# EAGLE design MIB (EAGLE 7.6.0)
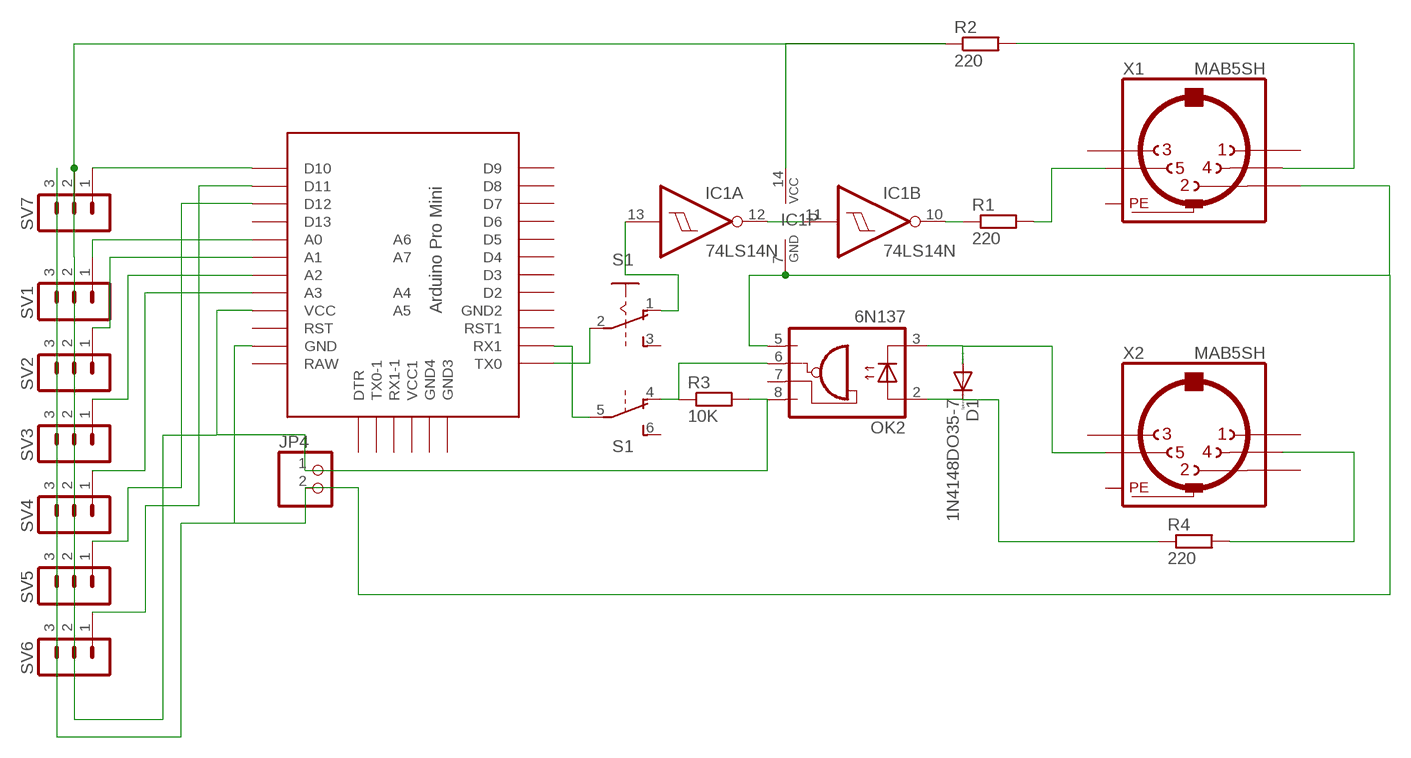
[diagram p0: schematic, sheet 1]

## Parts
D1  1N4148DO35-7  [DO35-7]
IC1  74LS14N  [DIL14]
JP4  PINHD-1X2  [1X02]
OK2  6N137  [DIL08]
R1  220  R-EU_0207/10  [0207/10]
R2  220  R-EU_0207/10  [0207/10]
R3  10K  R-EU_0207/10  [0207/10]
R4  220  R-EU_0207/10  [0207/10]
S1  A68-A31  [A68-A31]
SV1  MA03-1  [MA03-1]
SV2  MA03-1  [MA03-1]
SV3  MA03-1  [MA03-1]
SV4  MA03-1  [MA03-1]
SV5  MA03-1  [MA03-1]
SV6  MA03-1  [MA03-1]
SV7  MA03-1  [MA03-1]
U$1  PRO-MINI-2  [PRO-MINI-2]
X1  MAB5SH  [MAB5SH]
X2  MAB5SH  [MAB5SH]

## Nets
N$1: S1.5(B:P) U$1.RX1
N$2: IC1.11(B:I) IC1.12(A:O)
N$3: IC1.10(B:O) R1.1
N$4: D1.C OK2.2(A) R4.1
N$5: R4.2 X2.4
N$6: D1.A OK2.3(C) X2.5
N$7: R1.2 X1.5
N$8: R2.2 X1.4
N$9: IC1.14(P:VCC) JP4.1 OK2.8(VCC) R2.1 R3.2 SV1.2 SV2.2 SV3.2 SV4.2 SV5.2 SV6.2 SV7.2 U$1.VCC
N$10: OK2.6(VO) R3.1 S1.4(B:O)
N$11: IC1.7(P:GND) JP4.2 OK2.5(GND) SV1.3 SV2.3 SV3.3 SV4.3 SV5.3 SV6.3 SV7.3 U$1.GND X1.2
N$13: SV2.1 U$1.A1
N$14: SV3.1 U$1.A2
N$15: SV4.1 U$1.A3
N$16: SV1.1 U$1.A0
N$18: SV5.1 U$1.D12
N$19: SV6.1 U$1.D11
N$22: IC1.13(A:I) S1.1(A:O)
N$23: S1.2(A:P) U$1.TX0
N$30: SV7.1 U$1.D10
Unconnected: IC1.1(D:I) IC1.2(D:O) IC1.3(E:I) IC1.4(E:O) IC1.5(F:I) IC1.6(F:O) IC1.8(C:O) IC1.9(C:I) OK2.7(VE) S1.3(A:S) S1.6(B:S) U$1.A4 U$1.A5 U$1.A6 U$1.A7 U$1.D2 U$1.D3 U$1.D4 U$1.D5 U$1.D6 U$1.D7 U$1.D8 U$1.D9 U$1.D13 U$1.DTR U$1.GND1(GND2) U$1.GND2(GND3) U$1.GND3(GND4) U$1.RAW U$1.RST U$1.RST1 U$1.RX1-1 U$1.TX0-1 U$1.VCC1 X1.1 X1.3 X2.1 X2.2 X2.3

## Power pins joined to a net without a drawn wire
PE: X1.PE X1.PE@(PE) X2.PE X2.PE@(PE)

## Library data of the parts
D1 = diode:1N4148: DIODE high speed (Philips)
IC1 = 74xx-eu:74*14: Hex schmitt trigger INVERTER
JP4 = pinhead:PINHD-1X2: PIN HEADER
OK2 = optocoupler:6N137: MOTOROLA OPTO COUPLER; MPN: 6N137; OC_FARNELL: 1328376; OC_NEWARK: 52M1895
R1-R4 = rcl:R-EU_: RESISTOR, European symbol
S1 = switch:A68-A31: SLIDING SWITCH Siemens, distributor Buerklin, 11G766
SV1-SV7 = con-lstb:MA03-1: PIN HEADER; OC_FARNELL: unknown; OC_NEWARK: unknown
U$1 = Arduino-clone:PRO-MINI-2: Arduino Pro Mini Layout 2 Sparkfun.com
X1 X2 = con-hirschmann:MAB5SH: Female CONNECTOR 5 pins 90 deg. with shield, horizontal (DIN 41524); OC_FARNELL: 809883; OC_NEWARK: unknown

## Board
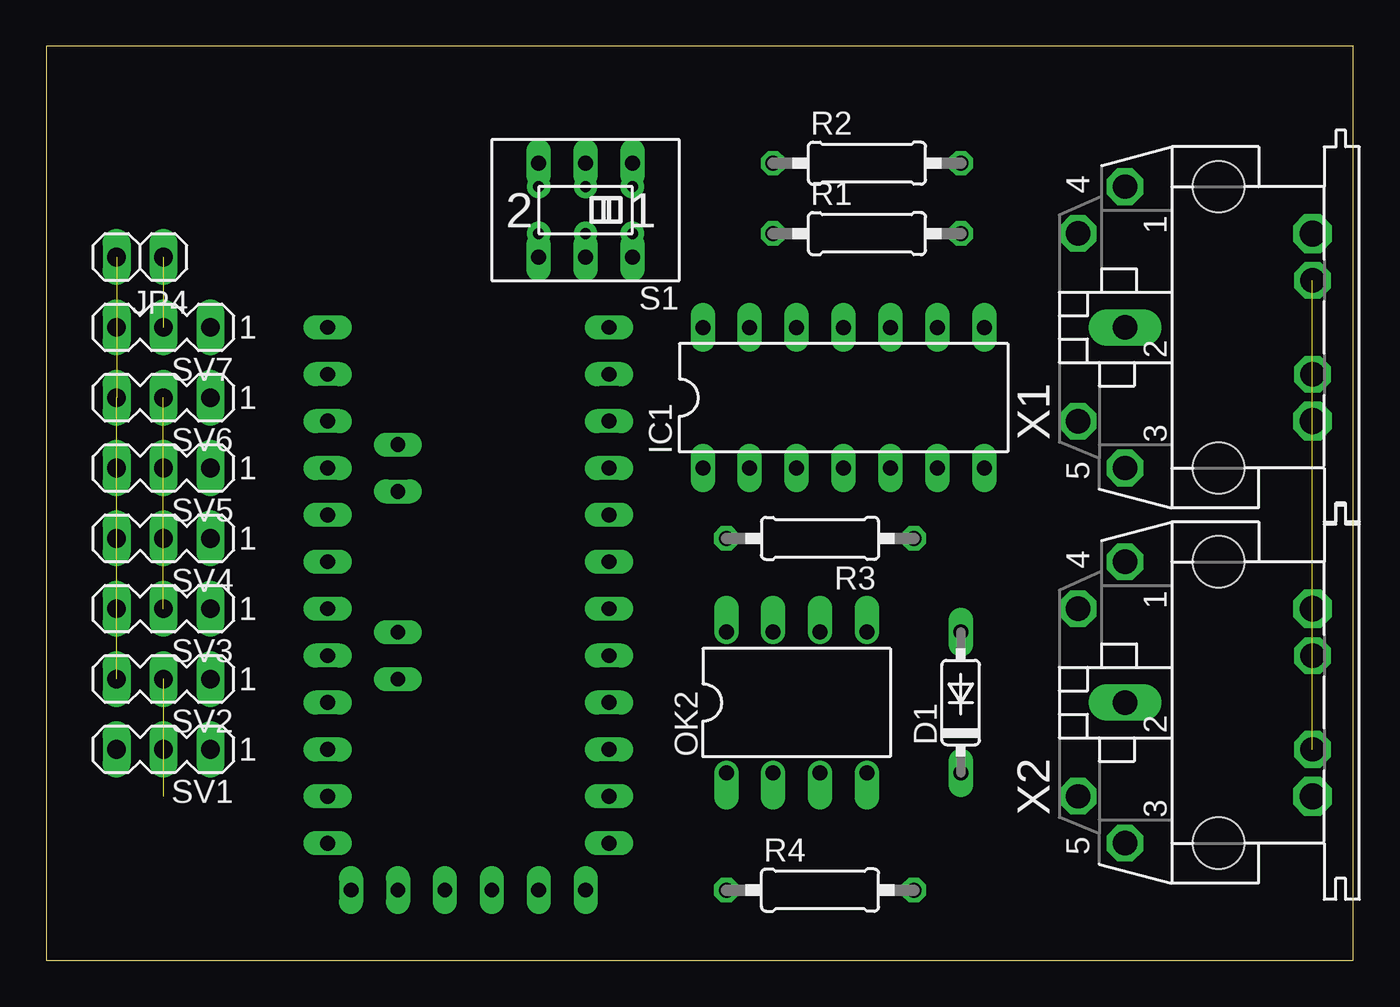
[diagram p1: board, top side]
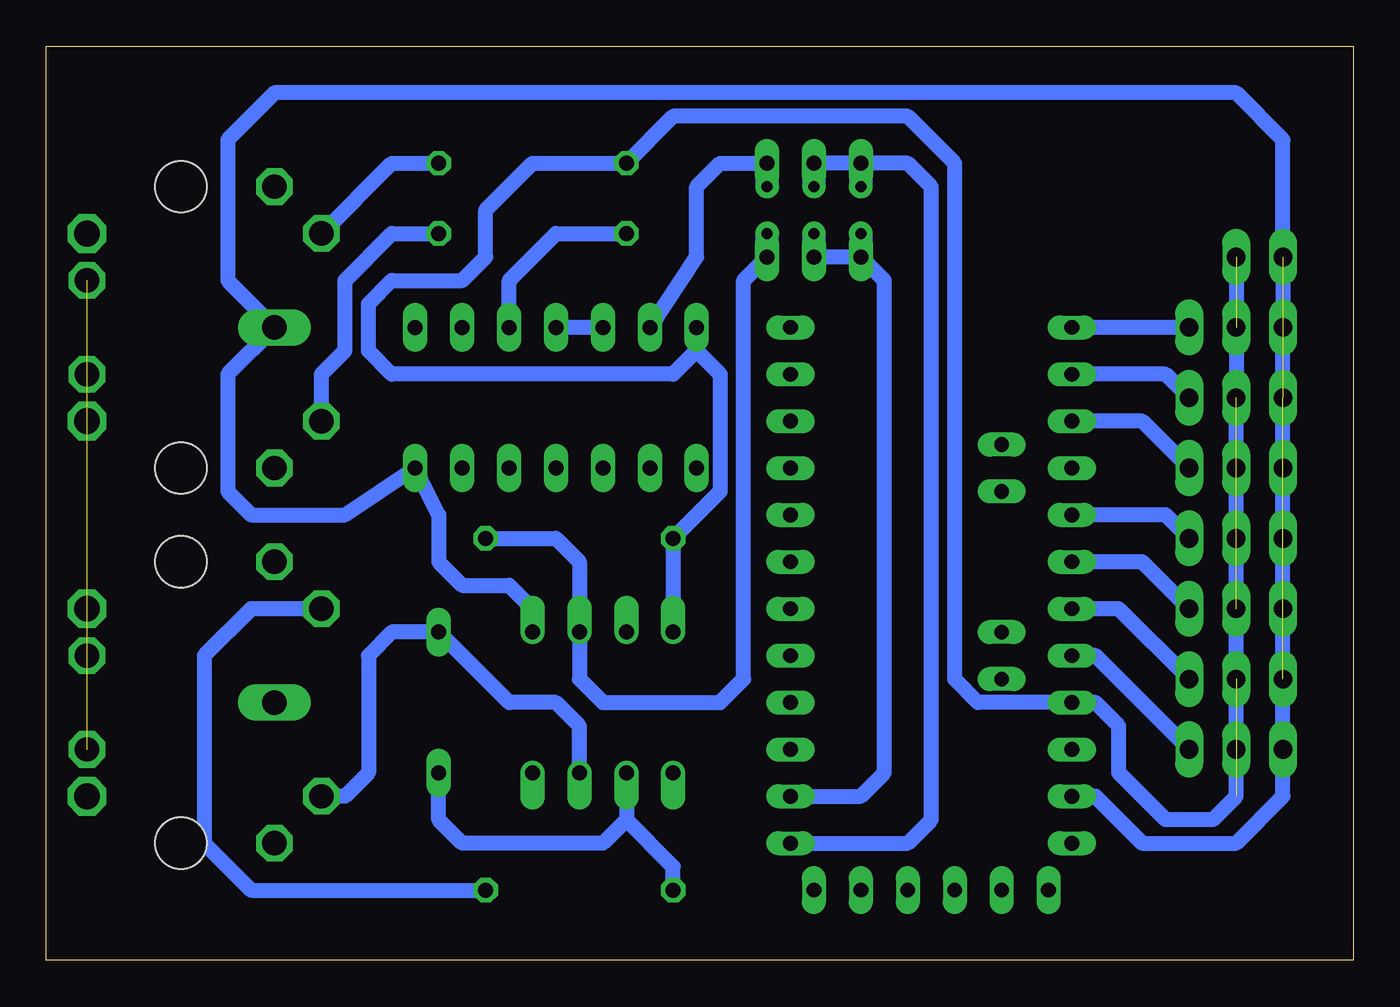
[diagram p2: board, bottom side, seen from below]

Size 70.79 x 49.52 mm. Coordinates in mm from the lower left corner, seen from the top.
Outline: 0,0 70.79,0 70.79,49.52 0,49.52 0,0
Copper layers (1*16): Top 0.035mm / dielectric 1.5mm / Bottom 0.035mm
Design rules "default": minimum track width 10mil, minimum drill 24mil, track to track 8mil, track to pad 8mil, pad to pad 8mil, via to via 8mil, smd to smd 8mil, copper to edge 40mil, drill to drill 8mil, minimum pad ring 10mil, minimum via ring 8mil, stop-mask expansion 4mil, vias tented up to drill 0mil, thermal gap 10mil

### Footprints (pad centres in the part's own frame; a part is rotated, then mirrored left to right if it is on the bottom)
DO35-7 = drill 0.813 long: A 3.81,0; C -3.81,0
DIL14 = drill 0.813 long: 1 -7.62,-3.81; 2 -5.08,-3.81; 3 -2.54,-3.81; 4 0,-3.81; 5 2.54,-3.81; 6 5.08,-3.81; 7 7.62,-3.81; 8 7.62,3.81; 9 5.08,3.81; 10 2.54,3.81; 11 0,3.81; 12 -2.54,3.81; 13 -5.08,3.81; 14 -7.62,3.81
1X02 = drill 1.016 long: 1 -1.27,0; 2 1.27,0
DIL08 = drill 0.813 offset: 1 -3.81,-3.81; 2 -1.27,-3.81; 3 1.27,-3.81; 4 3.81,-3.81; 5 3.81,3.81; 6 1.27,3.81; 7 -1.27,3.81; 8 -3.81,3.81
0207/10 = drill 0.813 octagon: 1 -5.08,0; 2 5.08,0
A68-A31 = drill 0.813 long: 1 -2.54,-2.54; 2 0,-2.54; 3 2.54,-2.54; 4 -2.54,2.54; 5 0,2.54; 6 2.54,2.54
MA03-1 = drill 1.016 long: 1 -2.54,0; 2 0,0; 3 2.54,0
PRO-MINI-2 = drill 0.8 long: A0 6.35,2.54; A1 6.35,0; A2 6.35,-2.54; A3 6.35,-5.08; A4 2.54,1.27; A5 2.54,3.81; A6 2.54,-8.89; A7 2.54,-6.35; D2 -8.89,2.54; D3 -8.89,0; D4 -8.89,-2.54; D5 -8.89,-5.08; D6 -8.89,-7.62; D7 -8.89,-10.16; D8 -8.89,-12.7; D9 -8.89,-15.24; D10 6.35,-15.24; D11 6.35,-12.7; D12 6.35,-10.16; D13 6.35,-7.62; DTR 5.08,15.24; GND 6.35,10.16; GND1 -8.89,5.08; GND2 -7.62,15.24; GND3 -5.08,15.24; RAW 6.35,12.7; RST 6.35,7.62; RST1 -8.89,7.62; RX1 -8.89,10.16; RX1-1 0,15.24; TX0 -8.89,12.7; TX0-1 2.54,15.24; VCC 6.35,5.08; VCC1 -2.54,15.24
MAB5SH = drill 1.321 octagon: 1 7.62,5.08; 3 -7.62,5.08; 4 5.08,7.62; 5 -5.08,7.62; PE -2.54,-5.08; PE@ 2.54,-5.08 | drill 1.321 long: 2 0,5.08 | hole 2.794: 7.62,0; -7.62,0

### Placement (x,y rotation side)
D1  49.53,13.97 90 top
IC1  43.18,30.48 0 top
JP4  5.08,38.1 180 top
OK2  40.64,13.97 0 top
R1  44.45,39.37 0 top
R2  44.45,43.18 0 top
R3  41.91,22.86 180 top
R4  41.91,3.81 0 top
S1  29.21,40.64 180 top
SV1  6.35,11.43 180 top
SV2  6.35,15.24 180 top
SV3  6.35,19.05 180 top
SV4  6.35,22.86 180 top
SV5  6.35,26.67 180 top
SV6  6.35,30.48 180 top
SV7  6.35,34.29 180 top
U$1  21.59,19.05 180 top
X1  63.5,34.29 90 top
X2  63.5,13.97 90 top

### Tracks (layer width: path | path; a pad name or v marks a point on that pad's centre or on a via)
N$1  (via drill 0.61 pad 1.27)
  Bottom 0.813: U$1.RX1 26.67,8.89 25.4,10.16 25.4,36.83 26.67,38.1 S1.5
  Bottom 1.27: 26.67,38.1 v26.67,39.37 | S1.5 v29.21,39.37
N$2
  Bottom 0.813: IC1.12 IC1.11
N$3
  Bottom 0.813: IC1.10 45.72,36.83 43.18,39.37 R1.1
N$4
  Bottom 0.813: R4.1 36.83,5.08 39.37,7.62 | OK2.2 39.37,7.62 | 39.37,7.62 40.64,6.35 48.26,6.35 49.53,7.62 D1.C
N$5
  Bottom 0.813: X2.4 59.69,19.05 62.23,16.51 62.23,6.35 59.69,3.81 R4.2
N$6
  Bottom 0.813: OK2.3 41.91,12.7 43.18,13.97 45.72,13.97 D1.A 52.07,17.78 53.34,16.51 53.34,10.16 54.61,8.89 X2.5
N$7
  Bottom 0.813: X1.5 55.88,31.75 54.61,33.02 54.61,36.83 52.07,39.37 R1.2
N$8
  Bottom 0.813: X1.4 52.07,43.18 R2.2
N$9  (6 unrouted)
  Bottom 0.813: JP4.1 SV6.2 6.35,8.89 7.62,7.62 10.16,7.62 12.7,10.16 12.7,12.7 13.97,13.97 U$1.VCC 20.32,13.97 21.59,15.24 21.59,43.18 24.13,45.72 36.83,45.72 R2.1 44.45,43.18 46.99,40.64 46.99,38.1 48.26,36.83 52.07,36.83 53.34,35.56 53.34,33.02 52.07,31.75 36.83,31.75 35.56,33.02 | OK2.8 R3.2 34.29,25.4 34.29,31.75 35.56,33.02 | 35.56,33.02 IC1.14
N$10  (via drill 0.61 pad 1.27)
  Bottom 0.813: R3.1 43.18,22.86 41.91,21.59 OK2.6 41.91,15.24 40.64,13.97 34.29,13.97 33.02,15.24 33.02,36.83 S1.4
  Bottom 1.27: S1.4 v31.75,39.37
N$11  (5 unrouted)
  Bottom 0.813: OK2.5 44.45,19.05 45.72,20.32 48.26,20.32 49.53,21.59 49.53,24.13 IC1.7 54.61,24.13 59.69,24.13 60.96,25.4 60.96,31.75 X1.2 60.96,36.83 60.96,44.45 58.42,46.99 6.35,46.99 3.81,44.45 JP4.2 SV7.3 SV1.3 3.81,8.89 6.35,6.35 11.43,6.35 13.97,8.89 U$1.GND
N$12  (via drill 1.4 pad 1.78)
  other vias: 68.58,8.89
N$13
  Bottom 0.813: SV2.1 12.7,19.05 U$1.A1
N$14
  Bottom 0.813: SV3.1 11.43,21.59 U$1.A2
N$15
  Bottom 0.813: SV4.1 10.16,24.13 U$1.A3
N$16
  Bottom 0.813: SV1.1 13.97,16.51 U$1.A0
N$17  (via drill 1.4 pad 1.78)
  other vias: 68.58,19.05
N$18
  Bottom 0.813: SV5.1 11.43,29.21 U$1.D12
N$19
  Bottom 0.813: SV6.1 10.16,31.75 U$1.D11
N$20  (via drill 1.4 pad 1.78)
  other vias: 68.58,29.21
N$21  (via drill 1.4 pad 1.78)
  other vias: 68.58,39.37
N$22  (via drill 0.61 pad 1.27)
  Bottom 0.813: IC1.13 35.56,38.1 35.56,41.91 34.29,43.18 S1.1
  Bottom 1.27: S1.1 v31.75,41.91
N$23  (via drill 0.61 pad 1.27)
  Bottom 0.813: U$1.TX0 24.13,6.35 22.86,7.62 22.86,41.91 24.13,43.18 26.67,43.18 S1.2
  Bottom 1.27: 26.67,43.18 v26.67,41.91 | S1.2 v29.21,41.91
N$30
  Bottom 0.813: SV7.1 U$1.D10
PE  (3 unrouted)